# Altium project Main Board V1.PrjPcb
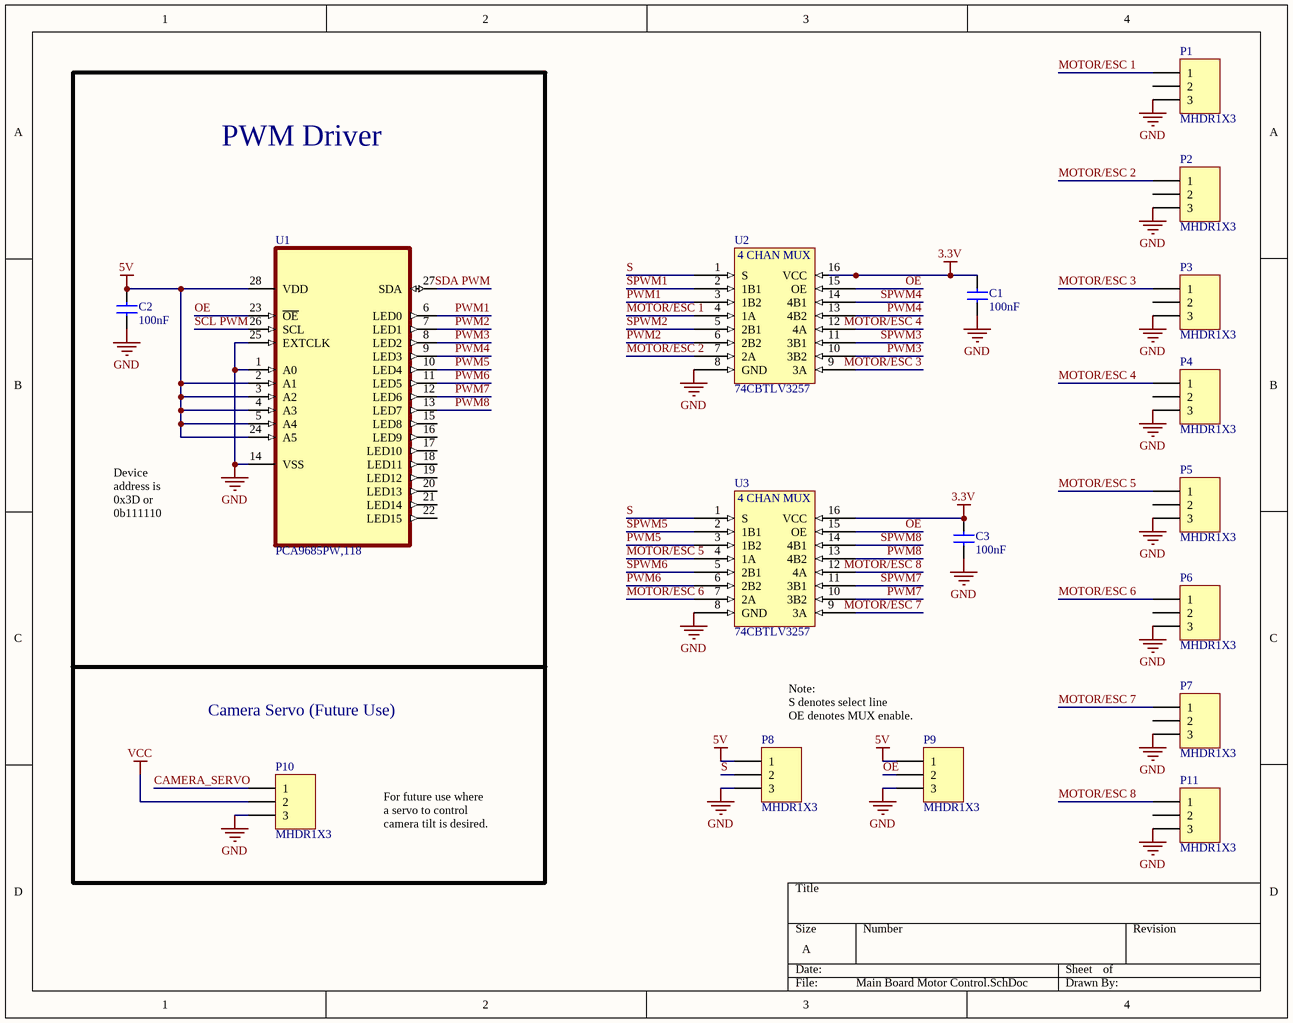
[diagram p0: Main Board Motor Control.SchDoc]
2 sheets, 29 parts. Net scope: global (net labels, ports and power ports of the same name join across sheets).
Board file: Main Board.PcbDoc
Sheets:
  Main Board Motor Control.SchDoc
  Main Board CAN Modules.SchDoc

## Sheet Main Board Motor Control.SchDoc
size A; SheetNumber: 1; SheetTotal: 3

### Parts
C1  value 100nF  [CAPC0603]  (hidden comment: Cap)
C2  value 100nF  [CAPC0603]  (hidden comment: Cap)
C3  value 100nF  [CAPC0603]  (hidden comment: Cap)
P1  MHDR1X3  [MHDR1X3]
P2  MHDR1X3  [MHDR1X3]
P3  MHDR1X3  [MHDR1X3]
P4  MHDR1X3  [MHDR1X3]
P5  MHDR1X3  [MHDR1X3]
P6  MHDR1X3  [MHDR1X3]
P7  MHDR1X3  [MHDR1X3]
P8  MHDR1X3  [MHDR1X3]
P9  MHDR1X3  [MHDR1X3]
P10  MHDR1X3  [MHDR1X3]
P11  MHDR1X3  [MHDR1X3]
U1  PCA9685PW,118  [SOP65P640X110-28N]
U2  74CBTLV3257  [TSSOP16]
U3  74CBTLV3257  [TSSOP16]

### Blocks framed on the sheet
PWM Driver: C2 U1

### Nets
3.3V: C1.1(A) C3.1(A) U2.16(VCC) U3.16(VCC)
5V: C2.1(A) P8.1 P9.1 U1.2(A1) U1.3(A2) U1.4(A3) U1.5(A4) U1.24(A5) U1.28(VDD)
GND: C1.2(B) C2.2(B) C3.2(B) P1.3 P2.3 P3.3 P4.3 P5.3 P6.3 P7.3 P8.3 P9.3 P10.3 P11.3 U1.1(A0) U1.14(VSS) U1.25(EXTCLK) U2.8(GND) U3.8(GND)
VCC: P10.2
CAMERA_SERVO: P10.1
MOTOR/ESC 1: P1.1 U2.4(1A)
MOTOR/ESC 2: P2.1 U2.7(2A)
MOTOR/ESC 3: P3.1 U2.9(3A)
MOTOR/ESC 4: P4.1 U2.12(4A)
MOTOR/ESC 5: P5.1 U3.4(1A)
MOTOR/ESC 6: P6.1 U3.7(2A)
MOTOR/ESC 7: P7.1 U3.9(3A)
MOTOR/ESC 8: P11.1 U3.12(4A)
OE: P9.2 U1.23(~{OE}) U2.15(OE) U3.15(OE)
PWM1: U1.6(LED0) U2.3(1B2)
PWM2: U1.7(LED1) U2.6(2B2)
PWM3: U1.8(LED2) U2.10(3B2)
PWM4: U1.9(LED3) U2.13(4B2)
PWM5: U1.10(LED4) U3.3(1B2)
PWM6: U1.11(LED5) U3.6(2B2)
PWM7: U1.12(LED6) U3.10(3B2)
PWM8: U1.13(LED7) U3.13(4B2)
S: P8.2 U2.1(S) U3.1(S)
SCL PWM: U1.26(SCL)
SDA PWM: U1.27(SDA)
SPWM1: U2.2(1B1)
SPWM2: U2.5(2B1)
SPWM3: U2.11(3B1)
SPWM4: U2.14(4B1)
SPWM5: U3.2(1B1)
SPWM6: U3.5(2B1)
SPWM7: U3.11(3B1)
SPWM8: U3.14(4B1)

Not connected (* = marked no-connect by the designer): P1 2; P2 2; P3 2; P4 2; P5 2; P6 2; P7 2; P11 2; U1 15(LED8) 16(LED9) 17(LED10) 18(LED11) 19(LED12) 20(LED13) 21(LED14) 22(LED15)

### Notes on the sheet
- Device address is 0x3D or 0b111110
- Camera Servo (Future Use)
- Note:
  S denotes select line
  OE denotes MUX enable.
- For future use where a servo to control camera tilt is desired.
- (in symbol 74CBTLV3257) 4 CHAN MUX

### Library data of the parts
P1-P11 = MHDR1X3: Header, 3-Pin; LatestRevisionDate: 17-Jul-2002; LatestRevisionNote: Re-released for DXP Platform.; Publisher: Altium Limited
U1 = PCA9685PW,118: LED Driver IC 16 Output Linear - PWM Dimming 25mA 28-TSSOP; MF: NXP USA; Value: *; MP: PCA9685PW,118; Purchase-URL: https://pricing.snapeda.com/search/part/PCA9685PW,118/?ref=eda; Availability: In Stock; Price: None; Package: TSSOP-28 NXP Semiconductors
U2 U3 = 74CBTLV3257: Mux; 4 channel; 2:1; Demux
C1-C3 = Cap: Supplier 1: Digi-Key; Supplier Part Number 1: 1276-1000-1-ND

## Sheet Main Board CAN Modules.SchDoc
size A; SheetNumber: 2; SheetTotal: 3
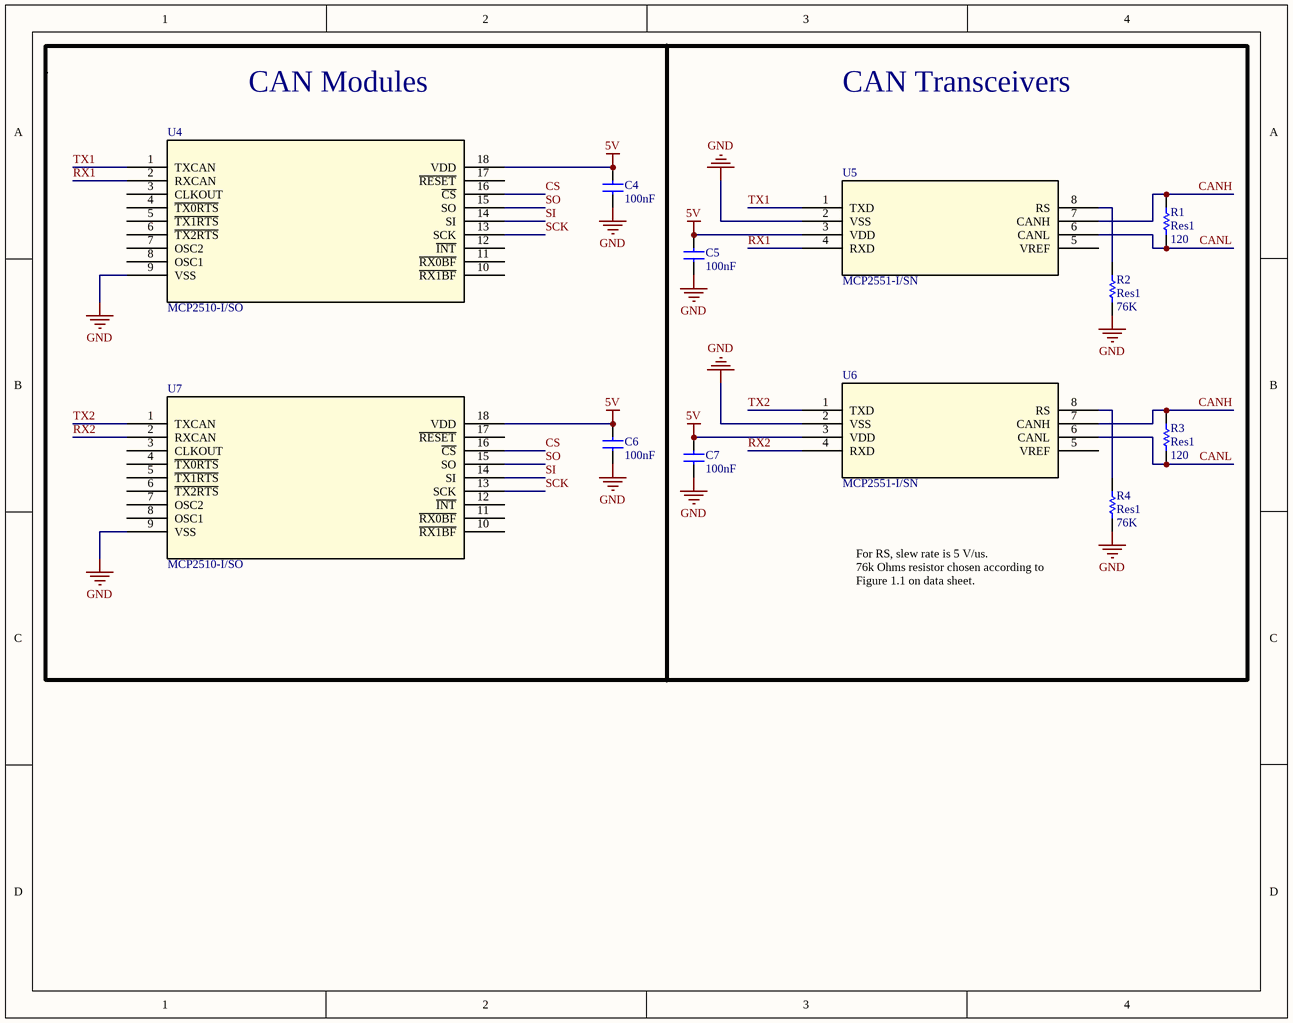
[diagram p1: Main Board CAN Modules.SchDoc]

### Parts
C4  value 100nF  [CAPC0603]  (hidden comment: Cap)
C5  value 100nF  [CAPC0603]  (hidden comment: Cap)
C6  value 100nF  [CAPC0603]  (hidden comment: Cap)
C7  value 100nF  [CAPC0603]  (hidden comment: Cap)
R1  Res1  value 120  [AXIAL-0.3]
R2  Res1  value 76K  [AXIAL-0.3]
R3  Res1  value 120  [AXIAL-0.3]
R4  Res1  value 76K  [AXIAL-0.3]
U4  MCP2510-I/SO  [SOIC18-W_MC_MCH]
U5  MCP2551-I/SN  [SOIC8-N_MC_MCH]
U6  MCP2551-I/SN  [SOIC8-N_MC_MCH]
U7  MCP2510-I/SO  [SOIC18-W_MC_MCH]

### Blocks framed on the sheet
CAN Modules: C4 C6 U4 U7

### Nets
5V: C4.1(A) C5.1(A) C6.1(A) C7.1(A) U4.18(VDD) U5.3(VDD) U6.3(VDD) U7.18(VDD)
GND: C4.2(B) C5.2(B) C6.2(B) C7.2(B) R2.2 R4.2 U4.9(VSS) U5.2(VSS) U6.2(VSS) U7.9(VSS)
CANH: R1.2 R3.2 U5.7(CANH) U6.7(CANH)
CANL: R1.1 R3.1 U5.6(CANL) U6.6(CANL)
CS: U4.16(~{CS}) U7.16(~{CS})
RX1: U4.2(RXCAN) U5.4(RXD)
RX2: U6.4(RXD) U7.2(RXCAN)
SCK: U4.13(SCK) U7.13(SCK)
SI: U4.14(SI) U7.14(SI)
SO: U4.15(SO) U7.15(SO)
TX1: U4.1(TXCAN) U5.1(TXD)
TX2: U6.1(TXD) U7.1(TXCAN)
NetR2_1: R2.1 U5.8(RS)
NetR4_1: R4.1 U6.8(RS)

Not connected (* = marked no-connect by the designer): U4 3(CLKOUT) 4(~{TX0RTS}) 5(~{TX1RTS}) 6(~{TX2RTS}) 7(OSC2) 8(OSC1) 10(~{RX1BF}) 11(~{RX0BF}) 12(~{INT}) 17(~{RESET}); U5 5(VREF); U6 5(VREF); U7 3(CLKOUT) 4(~{TX0RTS}) 5(~{TX1RTS}) 6(~{TX2RTS}) 7(OSC2) 8(OSC1) 10(~{RX1BF}) 11(~{RX0BF}) 12(~{INT}) 17(~{RESET})

### Notes on the sheet
- CAN Transceivers
- For RS, slew rate is 5 V/us.
  76k Ohms resistor chosen according to Figure 1.1 on data sheet.

### Library data of the parts
R1-R4 = Res1: Resistor; Published: 8-Jun-2000; LatestRevisionDate: 17-Jul-2002; LatestRevisionNote: Re-released for DXP Platform.; PackageReference: AXIAL-0.3; Publisher: Altium Limited; PackageDescription: Axial Device, Thru-Hole; 2 Leads; 0.3 in Pin Spacing
U4 U7 = MCP2510-I/SO: No Description Available; Mfr_Name: Microchip; RefDes: RefDes; Type: Type
U5 U6 = MCP2551-I/SN: No Description Available; Mfr_Name: Microchip; RefDes: RefDes; Type: Type
C4-C7 = Cap: Supplier 1: Digi-Key; Supplier Part Number 1: 1276-1000-1-ND

## Nets that join several sheets
5V: Main Board Motor Control (9 pins), Main Board CAN Modules (8 pins)
GND: Main Board Motor Control (19 pins), Main Board CAN Modules (10 pins)